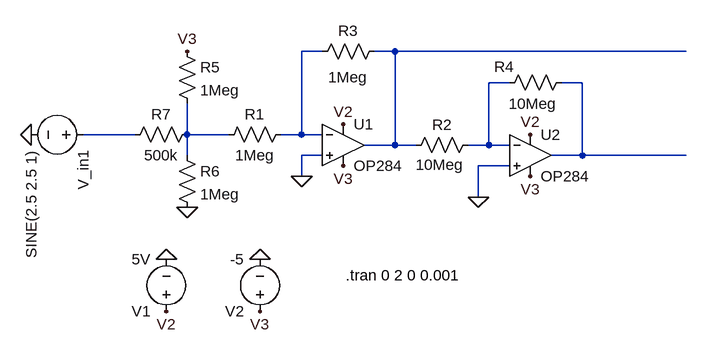
[diagram p0: schematic Part2_OpAmpOnly_Circuit.asc]
Part2_OpAmpOnly_Circuit.asc, the LTspice schematic file:
Version 4
SHEET 1 880 680
WIRE -112 112 -144 112
WIRE 0 112 -32 112
WIRE 448 112 0 112
WIRE 176 160 144 160
WIRE 288 160 256 160
WIRE -400 240 -480 240
WIRE -320 240 -320 192
WIRE -256 240 -320 240
WIRE -144 240 -144 112
WIRE -144 240 -176 240
WIRE -112 240 -144 240
WIRE 0 256 0 112
WIRE 0 256 -48 256
WIRE 32 256 0 256
WIRE 144 256 144 160
WIRE 144 256 112 256
WIRE 176 256 144 256
WIRE -320 272 -320 240
WIRE -112 272 -144 272
WIRE 288 272 288 160
WIRE 288 272 240 272
WIRE 448 272 288 272
WIRE 176 288 128 288
WIRE -144 304 -144 272
WIRE 128 336 128 288
FLAG -144 304 0
FLAG 128 336 0
FLAG -80 224 V2
FLAG 208 240 V2
FLAG -80 288 V3
FLAG 208 304 V3
FLAG -560 240 0
FLAG -352 512 V2
FLAG -352 432 0
FLAG -208 512 V3
FLAG -208 432 0
FLAG -320 112 V3
FLAG -320 352 0
SYMBOL res -160 224 R90
WINDOW 0 0 56 VBottom 2
WINDOW 3 32 56 VTop 2
SYMATTR InstName R1
SYMATTR Value 1Meg
SYMBOL Opamps\\OP284 -80 192 R0
SYMATTR InstName U1
SYMBOL Opamps\\OP284 208 208 R0
SYMATTR InstName U2
SYMBOL res 128 240 R90
WINDOW 0 0 56 VBottom 2
WINDOW 3 62 59 VBottom 2
SYMATTR InstName R2
SYMATTR Value 10Meg
SYMBOL res -16 96 R90
WINDOW 0 0 56 VBottom 2
WINDOW 3 40 57 VTop 2
SYMATTR InstName R3
SYMATTR Value 1Meg
SYMBOL res 272 144 R90
WINDOW 0 7 104 VBottom 2
WINDOW 3 33 60 VTop 2
SYMATTR InstName R4
SYMATTR Value 10Meg
SYMBOL voltage -464 240 R90
WINDOW 123 0 0 Left 0
WINDOW 39 0 0 Left 0
SYMATTR InstName V_in1
SYMATTR Value SINE(2.5 2.5 1)
SYMBOL voltage -352 528 R180
WINDOW 123 0 0 Left 0
WINDOW 39 0 0 Left 0
SYMATTR InstName V1
SYMATTR Value 5V
SYMBOL voltage -208 528 R180
WINDOW 123 0 0 Left 0
WINDOW 39 0 0 Left 0
SYMATTR InstName V2
SYMATTR Value -5
SYMBOL res -336 96 R0
SYMATTR InstName R5
SYMATTR Value 1Meg
SYMBOL res -336 256 R0
SYMATTR InstName R6
SYMATTR Value 1Meg
SYMBOL res -304 224 R90
WINDOW 0 0 56 VBottom 2
WINDOW 3 32 56 VTop 2
SYMATTR InstName R7
SYMATTR Value 500k
TEXT -76 456 Left 2 !.tran 0 2 0 0.001

The netlist it stands for:
* Part2_OpAmpOnly_Circuit.asc
R1 N001 N006 1Meg
XU1 0 N001 V2 V3 N002 OP284  ; pins In+ In- V+ V- OUT
XU2 0 N003 V2 V3 N004 OP284  ; pins In+ In- V+ V- OUT
R2 N003 N002 10Meg
R3 N002 N001 1Meg
R4 N004 N003 10Meg
V_in1 N005 0 SINE(2.5 2.5 1)
V1 V2 0 5V
V2 V3 0 -5
R5 V3 N006 1Meg
R6 N006 0 1Meg
R7 N006 N005 500k
.tran 0 2 0 0.001
.lib ADI1.lib
.backanno
.end